# EAGLE schematic pcb (EAGLE 7.7.0)
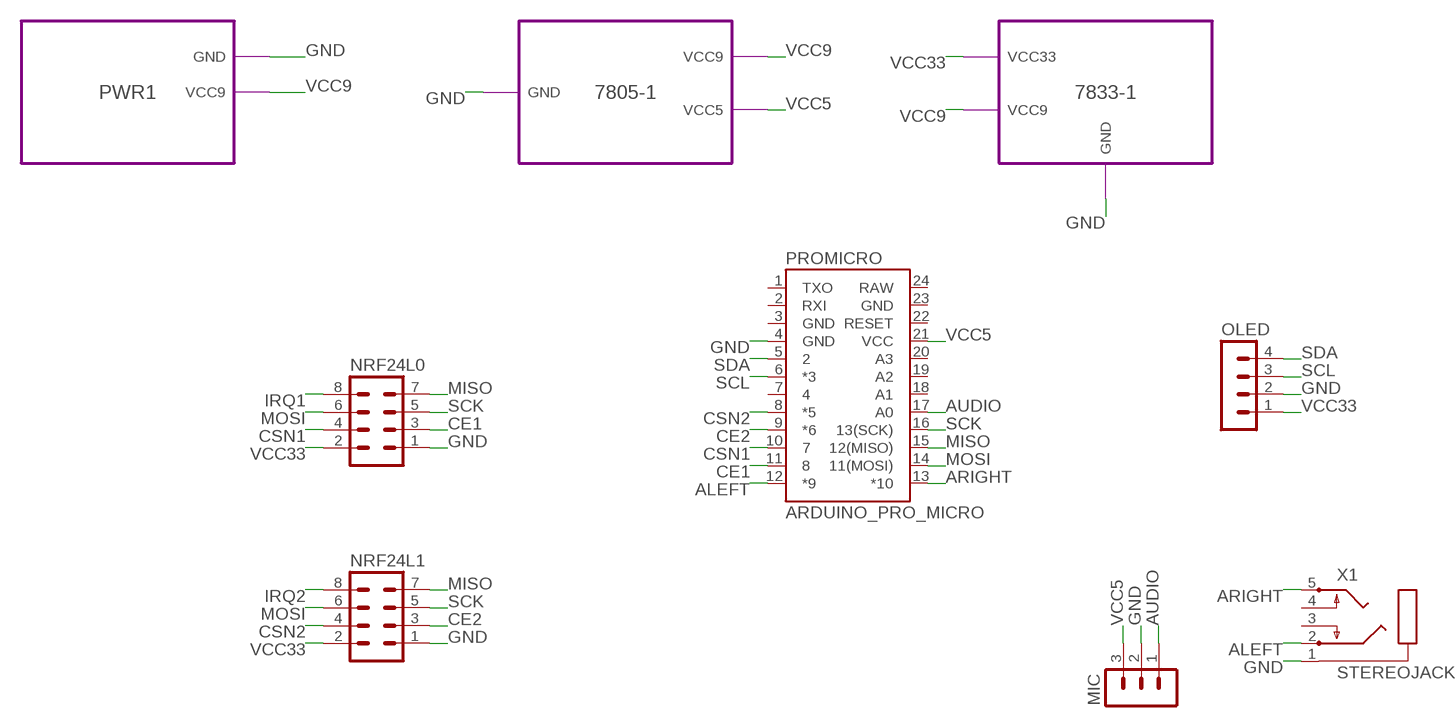
[diagram p0: schematic, sheet 1]

## Parts
MIC  MA03-1  [MA03-1]
NRF24L0  MA04-2  [MA04-2]
NRF24L1  MA04-2  [MA04-2]
OLED  MA04-1  [MA04-1]
PROMICRO  ARDUINO_PRO_MICRO  [ARDUINO_PRO_MICRO]
X1  STEREOJACK  [STX3100]

## Module instances
7805-1 = 7805
7833-1 = 7833
PWR1 = PWR

## Nets
ALEFT: PROMICRO.12(*9) X1.2
ARIGHT: PROMICRO.13(*10) X1.5
AUDIO: MIC.1 PROMICRO.17(A0)
CE1: NRF24L0.3 PROMICRO.11
CE2: NRF24L1.3 PROMICRO.9(*6)
CSN1: NRF24L0.4 PROMICRO.10
CSN2: NRF24L1.4 PROMICRO.8(*5)
GND: MIC.2 NRF24L0.1 NRF24L1.1 OLED.2 PROMICRO.4(GND) X1.1 ; port PWR1.GND 7805-1.GND 7833-1.GND
IRQ1: NRF24L0.8
IRQ2: NRF24L1.8
MISO: NRF24L0.7 NRF24L1.7 PROMICRO.15(12(MISO))
MOSI: NRF24L0.6 NRF24L1.6 PROMICRO.14(11(MOSI))
SCK: NRF24L0.5 NRF24L1.5 PROMICRO.16(13(SCK))
SCL: OLED.3 PROMICRO.6(*3)
SDA: OLED.4 PROMICRO.5
VCC5: MIC.3 PROMICRO.21(VCC) ; port 7805-1.VCC5
VCC9: port PWR1.VCC9 7805-1.VCC9 7833-1.VCC9
VCC33: NRF24L0.2 NRF24L1.2 OLED.1 ; port 7833-1.VCC33
Unconnected: PROMICRO.1(TXO) PROMICRO.2(RXI) PROMICRO.3(GND) PROMICRO.7 PROMICRO.18(A1) PROMICRO.19(A2) PROMICRO.20(A3) PROMICRO.22(RESET) PROMICRO.23(GND) PROMICRO.24(RAW) X1.3 X1.4

## Library data of the parts
MIC = 00-con-lstb_edited_LongPadsSlk:MA03-1: PIN HEADER; OC_FARNELL: unknown; OC_NEWARK: unknown
NRF24L0 NRF24L1 = con-lstb:MA04-2: PIN HEADER; OC_FARNELL: unknown; OC_NEWARK: unknown
OLED = con-lstb:MA04-1: PIN HEADER; OC_FARNELL: unknown; OC_NEWARK: unknown
PROMICRO = SparkFun-Boards:ARDUINO_PRO_MICRO
X1 = adafruit:STEREOJACK: MIC/HEADPHONE JACK Stereo jack with two switches. Kycon STX3100, CUI SJ1-3555NG and/or 4UCon 05544

## Module 7805
Ports: VCC9(io) VCC5(io) GND(io)
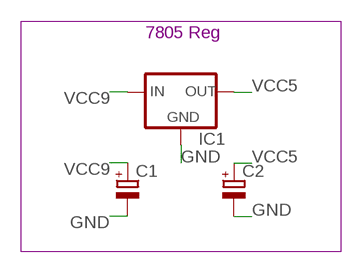
[diagram p1: schematic, module 7805, sheet 1]

### Parts
C1  CPOL-EUE2,5-6E  [E2,5-6E]
C2  CPOL-EUE2,5-6E  [E2,5-6E]
IC1  78XXS  [78XXS]

### Nets
GND: C1.- C2.- IC1.GND
VCC5: C2.+ IC1.OUT
VCC9: C1.+ IC1.IN

### Notes on the sheet
- 7805 Reg

### Library data of the parts
C1 C2 = rcl:CPOL-EU: POLARIZED CAPACITOR, European symbol
IC1 = v-reg:78XXS: VOLTAGE REGULATOR

## Module 7833
Ports: VCC33(io) VCC9(io) GND(io)
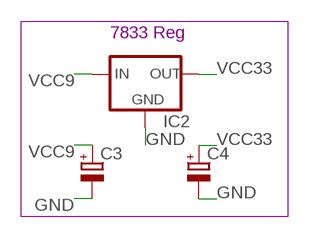
[diagram p2: schematic, module 7833, sheet 1]

### Parts
C3  CPOL-EUE2,5-6E  [E2,5-6E]
C4  CPOL-EUE2,5-6E  [E2,5-6E]
IC2  78XXS  [78XXS]

### Nets
GND: C3.- C4.- IC2.GND
VCC9: C3.+ IC2.IN
VCC33: C4.+ IC2.OUT

### Notes on the sheet
- 7833 Reg

### Library data of the parts
C3 C4 = rcl:CPOL-EU: POLARIZED CAPACITOR, European symbol
IC2 = v-reg:78XXS: VOLTAGE REGULATOR

## Module DAC558
Ports: 
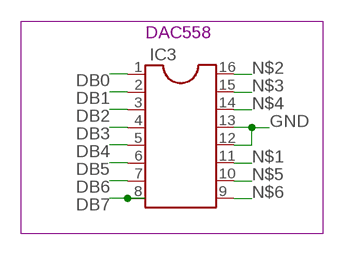
[diagram p3: schematic, module DAC558, sheet 1]

### Parts
IC3  DIL16S  [SOCKET-16]

### Nets
DB0: IC3.1
DB1: IC3.2
DB2: IC3.3
DB3: IC3.4
DB4: IC3.5
DB5: IC3.6
DB6: IC3.7
DB7: IC3.8
GND: IC3.12 IC3.13
N$1: IC3.11
N$2: IC3.16
N$3: IC3.15
N$4: IC3.14
N$5: IC3.10
N$6: IC3.9

### Notes on the sheet
- DAC558

### Library data of the parts
IC3 = ic-package:DIL16: Dual In Line / Socket

## Module PWR
Ports: VCC9(io) GND(io)
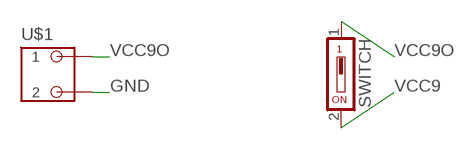
[diagram p4: schematic, module PWR, sheet 1]

### Parts
SWITCH  DS01  [DS-01]
U$1  SPTBB2-A2  [SPTB]

### Nets
GND: U$1.A2
VCC9: SWITCH.2
VCC9O: SWITCH.1 U$1.B2

### Library data of the parts
SWITCH = switch-dil:DS01: DIL/CODE SWITCH; OC_FARNELL: unknown; OC_NEWARK: unknown
U$1 = #rcn-15:SPTB